# EAGLE board pocketbeagle-breakout (EAGLE 9.2.2), part 1 of 2
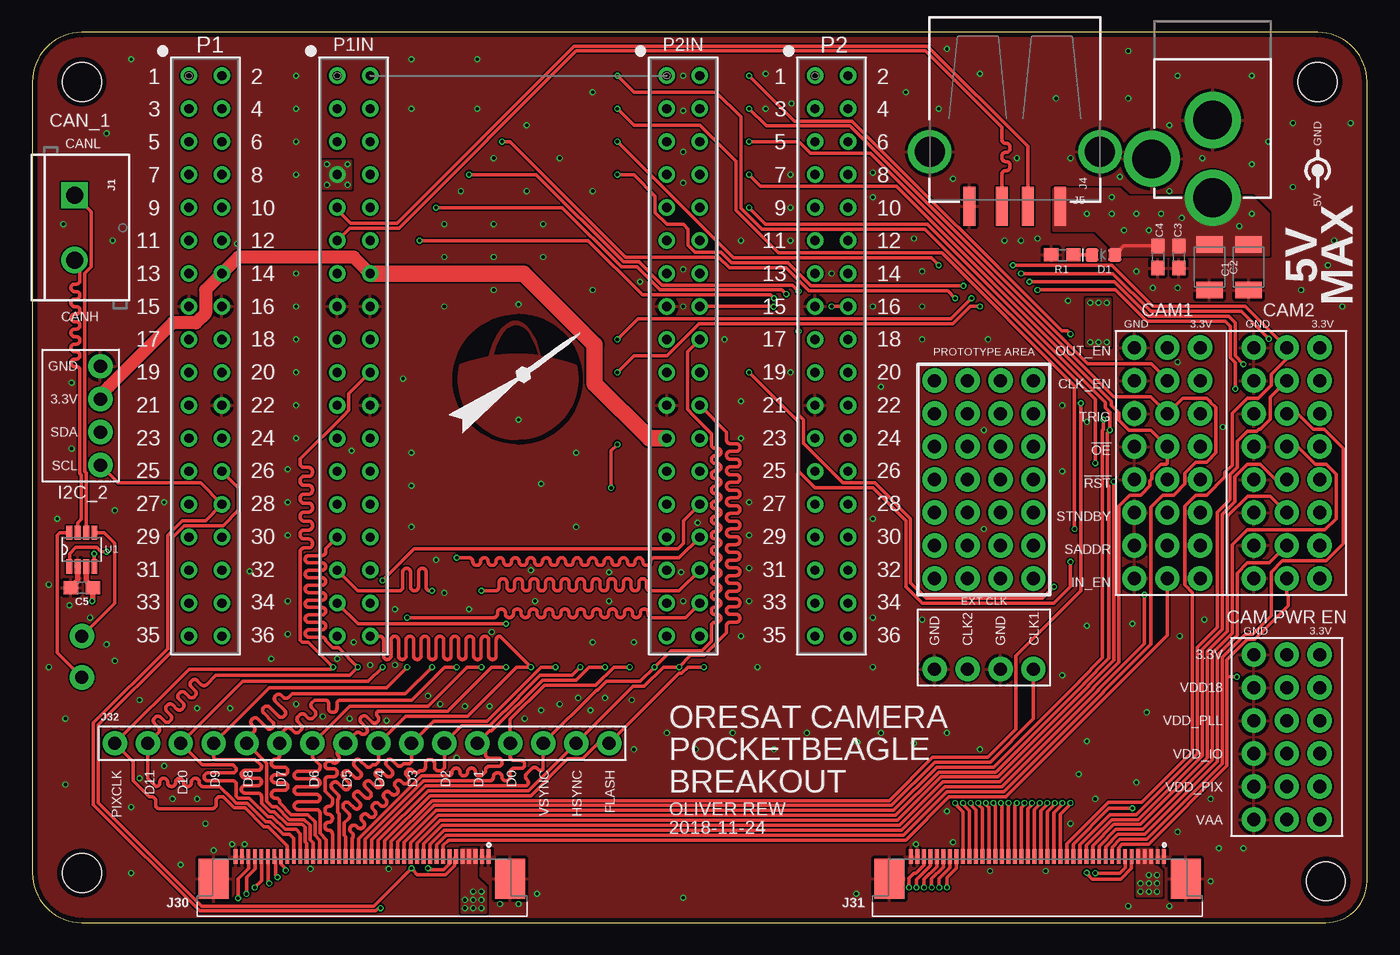
[diagram p1: board, top side]
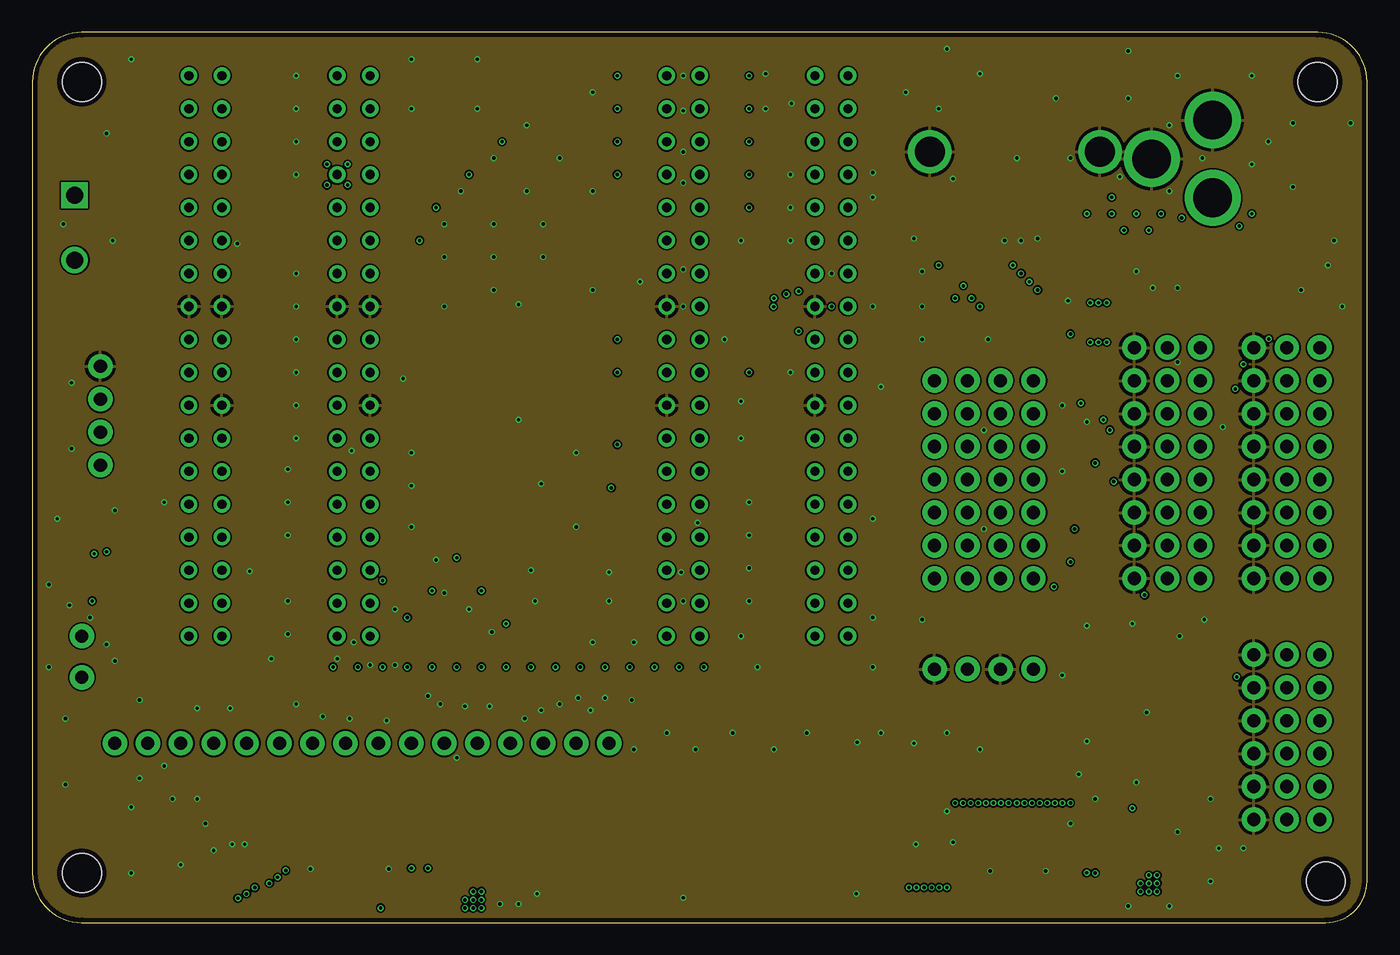
[diagram p2: board, inner layer Route2]
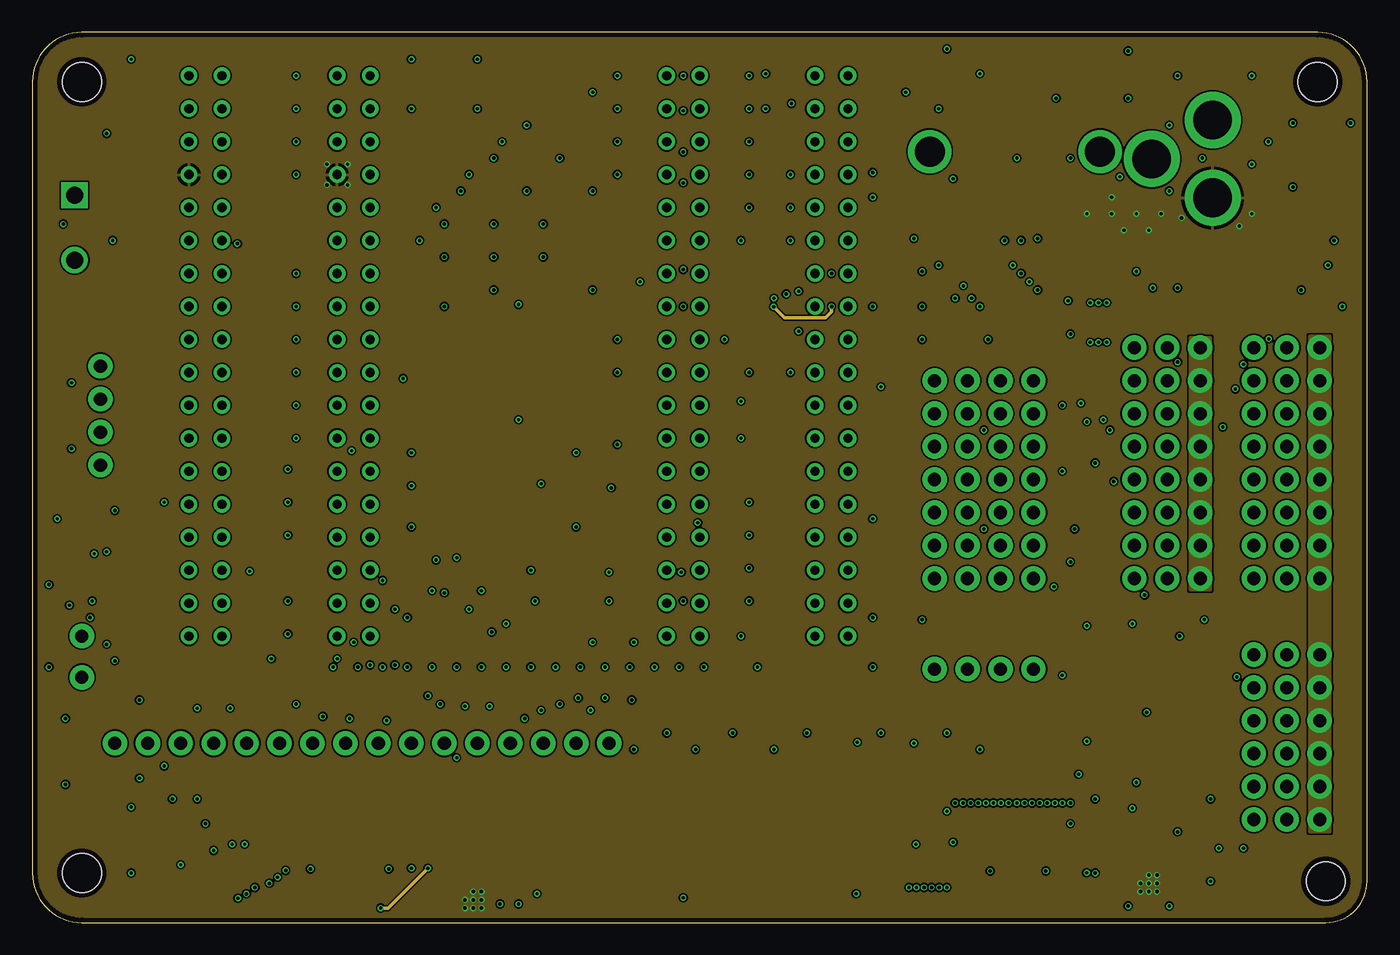
[diagram p3: board, inner layer Route15]
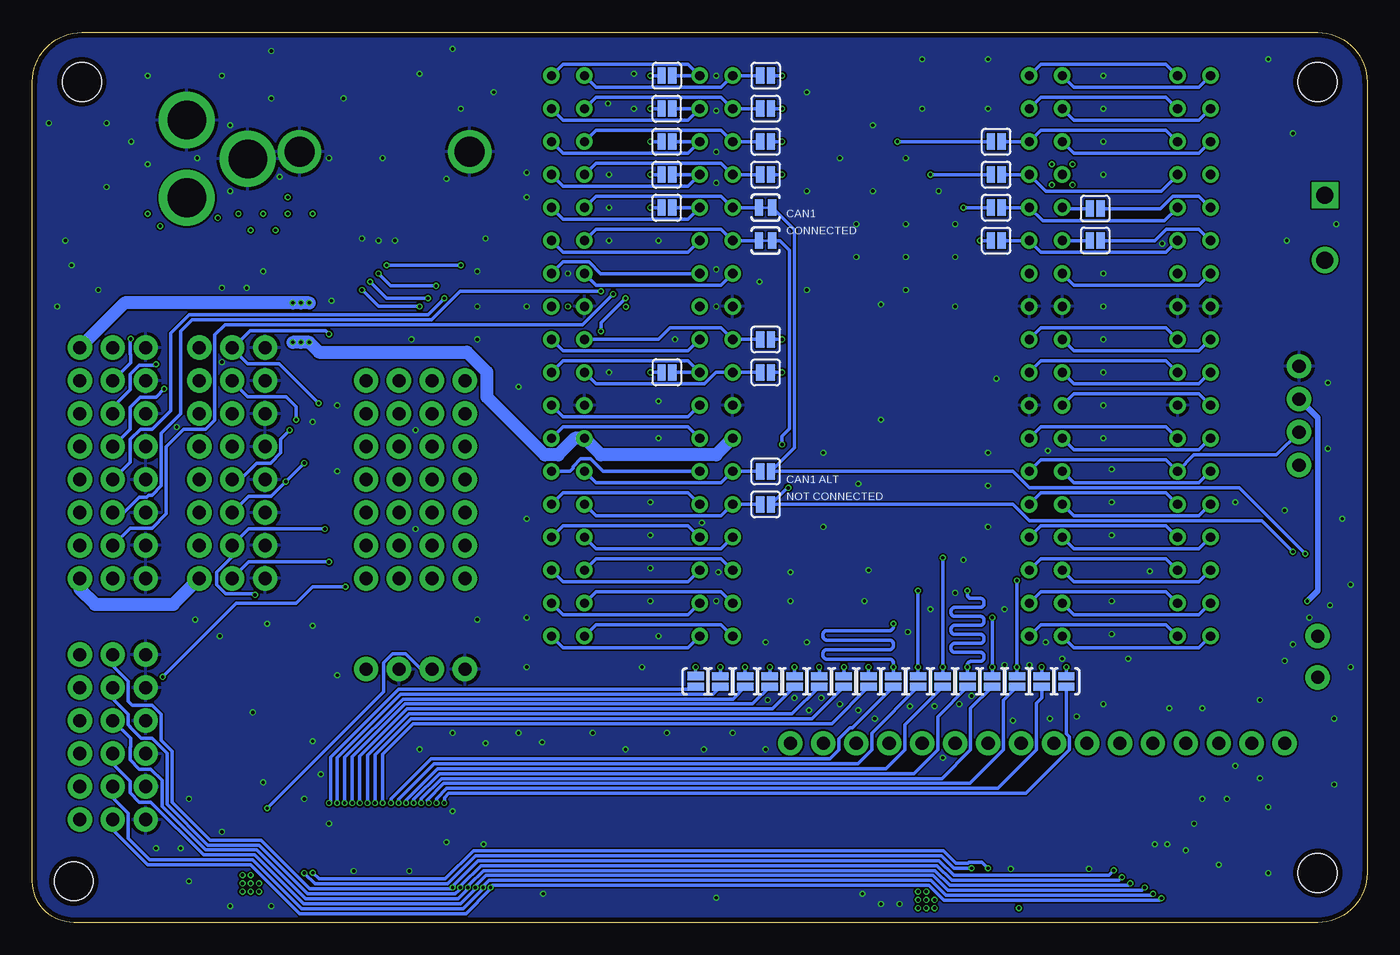
[diagram p4: board, bottom side, seen from below]

Size 102.87 x 68.58 mm. Coordinates in mm from the lower left corner, seen from the top.
Outline: 3.81,0 99.69,0 arc90 102.87,3.17 102.87,64.77 arc90 99.06,68.58 3.81,68.58 arc90 0,64.77 0,3.81 arc90 3.81,0
Copper layers (1*2*15*16): Top 0.035559375mm / dielectric 0.17018125mm / Route2 0.01778125mm / dielectric 47mil / Route15 0.01778125mm / dielectric 0.17018125mm / Bottom 0.035559375mm
Design rules "oshpark-4layer-tented": minimum track width 5mil, minimum drill 10mil, track to track 5mil, track to pad 5mil, pad to pad 5mil, via to via 5mil, smd to smd 5mil, copper to edge 15mil, drill to drill 6mil, minimum pad ring 4mil, minimum via ring 4mil, stop-mask expansion 2.5mil, vias tented up to drill 20mil, thermal gap 10mil
Holes 3 mm at 3.81,3.81 99.69,3.17 3.81,64.77 99.06,64.77

## Footprints (pad centres in the part's own frame; a part is rotated, then mirrored left to right if it is on the bottom)
1210 = smd 1.27 x 2.06: 1 -1.755,0; 2 1.755,0
0603 = smd 1.1 x 1: 1 -0.85,0; 2 0.85,0
LED-0603 = smd 1 x 1: A -0.877,0; C 0.877,0
SCREWTERMINAL-5MM-2 = drill 1.3 pad 2.032 square: 1 0,0 | drill 1.3 pad 2.032: 2 5,0
1X03_NO_SILK = drill 1.016 pad 1.88: 1 0,0; 2 2.54,0; 3 5.08,0
USB-A-S-SILK-FEMALE = smd 3 x 0.9: D+ 7.212,-1; D- 7.212,1; GND 7.212,-3.5; VBUS 7.212,3.5 | drill 2.311: SHLD1 3,-6.566; SHLD2 3,6.566
POWER_JACK_PTH = drill 2.997 pad 4.318: GND 0,7.7; GNDBREAK 4.7,10.7; PWR 0,13.7
1X04_NO_SILK = drill 1.016 pad 1.88: 1 0,0; 2 2.54,0; 3 5.08,0; 4 7.62,0
TE_4-1734592-0 = smd 0.3 x 1.1: 1 -9.75,0; 2 -9.25,0; 3 -8.75,0; 4 -8.25,0; 5 -7.75,0; 6 -7.25,0; 7 -6.75,0; 8 -6.25,0; 9 -5.75,0; 10 -5.25,0; 11 -4.75,0; 12 -4.25,0; 13 -3.75,0; 14 -3.25,0; 15 -2.75,0; 16 -2.25,0; 17 -1.75,0; 18 -1.25,0; 19 -0.75,0; 20 -0.25,0; 21 0.25,0; 22 0.75,0; 23 1.25,0; 24 1.75,0; 25 2.25,0; 26 2.75,0; 27 3.25,0; 28 3.75,0; 29 4.25,0; 30 4.75,0; 31 5.25,0; 32 5.75,0; 33 6.25,0; 34 6.75,0; 35 7.25,0; 36 7.75,0; 37 8.25,0; 38 8.75,0; 39 9.25,0; 40 9.75,0 | smd 2.3 x 3.1: S1 11.42,1.7; S2 -11.42,1.7
1X16_NO_SILK = drill 1.016 pad 1.88: 1 0,0; 2 2.54,0; 3 5.08,0; 4 7.62,0; 5 10.16,0; 6 12.7,0; 7 15.24,0; 8 17.78,0; 9 20.32,0; 10 22.86,0; 11 25.4,0; 12 27.94,0; 13 30.48,0; 14 33.02,0; 15 35.56,0; 16 38.1,0
1X01_NO_SILK = drill 1.016 pad 1.88: 1 0,0
CON36_2X18_TU_BCS = drill 0.711 pad 1.27: 1 21.59,1.27; 2 21.59,-1.27; 3 19.05,1.27; 4 19.05,-1.27; 5 16.51,1.27; 6 16.51,-1.27; 7 13.97,1.27; 8 13.97,-1.27; 9 11.43,1.27; 10 11.43,-1.27; 11 8.89,1.27; 12 8.89,-1.27; 13 6.35,1.27; 14 6.35,-1.27; 15 3.81,1.27; 16 3.81,-1.27; 17 1.27,1.27; 18 1.27,-1.27; 19 -1.27,1.27; 20 -1.27,-1.27; 21 -3.81,1.27; 22 -3.81,-1.27; 23 -6.35,1.27; 24 -6.35,-1.27; 25 -8.89,1.27; 26 -8.89,-1.27; 27 -11.43,1.27; 28 -11.43,-1.27; 29 -13.97,1.27; 30 -13.97,-1.27; 31 -16.51,1.27; 32 -16.51,-1.27; 33 -19.05,1.27; 34 -19.05,-1.27; 35 -21.59,1.27; 36 -21.59,-1.27
SJ_2S-NOTRACE = smd 0.635 x 1.27: 1 -0.401,0; 2 0.413,0
SJ_2S = smd 0.635 x 1.27: 1 -0.412,0; 2 0.412,0
SJ_2S-TRACE = smd 0.635 x 1.27: 1 -0.508,0; 2 0.508,0
SOT23-8_TI-DCN = smd 0.45 x 1.1: 1 -0.975,-1.3; 2 -0.325,-1.3; 3 0.325,-1.3; 4 0.975,-1.3; 5 0.975,1.3; 6 0.325,1.3; 7 -0.325,1.3; 8 -0.975,1.3

## Placement (x,y rotation side)
C1  22UF  [1210]  93.74,50.48 270 top
C2  22UF  [1210]  90.73,50.48 270 top
C3  0.1uF  [0603]  88.34,51.28 270 top
C4  0.1uF  [0603]  86.76,51.28 270 top
C5  0.1uF  [0603]  3.81,25.8 180 top
D1  GREEN  [LED-0603]  82.55,51.44 180 top
J1  [SCREWTERMINAL-5MM-2]  3.25,56.04 270 top
J3  [1X03_NO_SILK]  84.93,29.05 0 top
J4  USB_A_SMT_FEMALE  [USB-A-S-SILK-FEMALE]  75.72,62.39 270 top
J5  POWER_JACK  [POWER_JACK_PTH]  90.96,69.53 180 top
J6  [1X03_NO_SILK]  94.14,29.05 0 top
J7  [1X03_NO_SILK]  94.14,31.59 0 top
J8  [1X03_NO_SILK]  94.14,34.13 0 top
J9  [1X03_NO_SILK]  94.14,36.67 0 top
J10  [1X03_NO_SILK]  94.14,39.21 0 top
J11  [1X03_NO_SILK]  94.14,41.75 0 top
J12  [1X03_NO_SILK]  94.14,7.94 0 top
J13  [1X03_NO_SILK]  94.14,10.48 0 top
J14  [1X03_NO_SILK]  94.14,13.02 0 top
J15  [1X03_NO_SILK]  94.14,15.56 0 top
J16  [1X03_NO_SILK]  94.14,18.1 0 top
J17  [1X03_NO_SILK]  94.14,20.64 0 top
J18  [1X03_NO_SILK]  94.14,26.51 0 top
J19  [1X04_NO_SILK]  5.24,42.86 270 top
J20  [1X03_NO_SILK]  94.14,44.29 0 top
J22  [1X03_NO_SILK]  84.93,31.59 0 top
J23  [1X03_NO_SILK]  84.93,34.13 0 top
J24  [1X03_NO_SILK]  84.93,36.67 180 bottom
J25  [1X03_NO_SILK]  84.93,39.21 0 top
J26  [1X03_NO_SILK]  84.93,41.75 0 top
J27  [1X03_NO_SILK]  84.93,26.51 0 top
J28  [1X03_NO_SILK]  84.93,44.29 0 top
J30  4-1734592-04-1734592-0  [TE_4-1734592-0]  25.4,5.08 180 top
J31  4-1734592-04-1734592-0  [TE_4-1734592-0]  77.47,5.08 180 top
J32  [1X16_NO_SILK]  6.35,13.81 0 top
J36  [1X01_NO_SILK]  3.81,22.07 180 top
J37  [1X01_NO_SILK]  3.81,18.89 180 top
J38  [1X04_NO_SILK]  69.53,19.53 0 top
J39  [1X04_NO_SILK]  69.53,41.75 0 top
J40  [1X04_NO_SILK]  69.53,39.21 0 top
J41  [1X04_NO_SILK]  69.53,36.67 0 top
J42  [1X04_NO_SILK]  69.53,34.13 0 top
J43  [1X04_NO_SILK]  69.53,31.59 0 top
J44  [1X04_NO_SILK]  69.53,29.05 0 top
J45  [1X04_NO_SILK]  69.53,26.51 0 top
P1  BCS-118-L-D-TE  [CON36_2X18_TU_BCS]  13.34,43.66 90 top
P1IN  BCS-118-L-D-TE  [CON36_2X18_TU_BCS]  24.77,43.66 90 top
P2  BCS-118-L-D-TE  [CON36_2X18_TU_BCS]  61.59,43.66 90 top
P2IN  BCS-118-L-D-TE  [CON36_2X18_TU_BCS]  50.16,43.66 90 top
R1  1k  [0603]  79.38,51.44 180 top
SJ1  SOLDERJUMPERNC2  [SJ_2S-NOTRACE]  23.18,18.57 270 bottom
SJ2  SOLDERJUMPERNC2  [SJ_2S-NOTRACE]  47.94,18.57 270 bottom
SJ3  SOLDERJUMPERNC2  [SJ_2S-NOTRACE]  49.85,18.57 270 bottom
SJ4  SOLDERJUMPERNC2  [SJ_2S-NOTRACE]  25.08,18.57 270 bottom
SJ5  SOLDERJUMPERNC2  [SJ_2S-NOTRACE]  26.99,18.57 270 bottom
SJ6  SOLDERJUMPERNC2  [SJ_2S-NOTRACE]  28.89,18.57 270 bottom
SJ7  SOLDERJUMPERNC2  [SJ_2S-NOTRACE]  30.8,18.57 270 bottom
SJ8  SOLDERJUMPERNC2  [SJ_2S-NOTRACE]  32.7,18.57 270 bottom
SJ9  SOLDERJUMPERNC2  [SJ_2S-NOTRACE]  34.61,18.57 270 bottom
SJ10  SOLDERJUMPERNC2  [SJ_2S-NOTRACE]  36.51,18.57 270 bottom
SJ11  SOLDERJUMPERNC2  [SJ_2S-NOTRACE]  38.42,18.57 270 bottom
SJ12  SOLDERJUMPERNC2  [SJ_2S-NOTRACE]  40.32,18.57 270 bottom
SJ13  SOLDERJUMPERNC2  [SJ_2S-NOTRACE]  42.23,18.57 270 bottom
SJ14  SOLDERJUMPERNC2  [SJ_2S-NOTRACE]  44.13,18.57 270 bottom
SJ15  SOLDERJUMPERNC2  [SJ_2S-NOTRACE]  46.04,18.57 270 bottom
SJ16  SOLDERJUMPERNC2  [SJ_2S-NOTRACE]  51.75,18.57 90 bottom
SJ17  SOLDERJUMPERNC  [SJ_2S]  46.35,34.77 0 bottom
SJ18  SOLDERJUMPERNC  [SJ_2S]  46.35,32.23 0 bottom
SJ19  SOLDERJUMPERTRACE  [SJ_2S-TRACE]  46.35,55.09 0 bottom
SJ20  SOLDERJUMPERTRACE  [SJ_2S-TRACE]  46.35,52.55 0 bottom
SJ21  SOLDERJUMPERNC  [SJ_2S]  46.35,62.71 180 bottom
SJ22  SOLDERJUMPERNC  [SJ_2S]  46.35,65.25 180 bottom
SJ23  SOLDERJUMPERNC  [SJ_2S]  53.98,55.09 0 bottom
SJ24  SOLDERJUMPERNC  [SJ_2S]  53.98,57.63 0 bottom
SJ25  SOLDERJUMPERNC  [SJ_2S]  53.98,60.17 0 bottom
SJ26  SOLDERJUMPERNC  [SJ_2S]  46.35,44.93 0 bottom
SJ27  SOLDERJUMPERNC  [SJ_2S]  46.35,42.39 0 bottom
SJ28  SOLDERJUMPERNC  [SJ_2S]  46.35,60.17 0 bottom
SJ29  SOLDERJUMPERNC  [SJ_2S]  46.35,57.63 0 bottom
SJ30  SOLDERJUMPERNC  [SJ_2S]  28.57,60.17 0 bottom
SJ31  SOLDERJUMPERNC  [SJ_2S]  28.57,57.63 0 bottom
SJ32  SOLDERJUMPERNC  [SJ_2S]  28.57,55.09 0 bottom
SJ33  SOLDERJUMPERNC  [SJ_2S]  28.57,52.55 0 bottom
SJ34  SOLDERJUMPERNC  [SJ_2S]  53.98,65.25 180 bottom
SJ35  SOLDERJUMPERNC  [SJ_2S]  53.98,42.39 180 bottom
SJ36  SOLDERJUMPERNC  [SJ_2S]  53.98,62.71 0 bottom
SJ37  SOLDERJUMPERNC  [SJ_2S]  20.95,55.01 180 bottom
SJ38  SOLDERJUMPERNC  [SJ_2S]  20.95,52.55 180 bottom
U1  TCAN330  [SOT23-8_TI-DCN]  3.81,28.73 0 top
U$1  [PSAS_LOGO_10X10_NEW]  37.47,41.91 0 top
U$2  [POLARITY_SYMBOL_SMALL]  99.06,57.94 90 top